# EAGLE design 4x4_hirose_100drill_250pad (EAGLE 7.3.0)
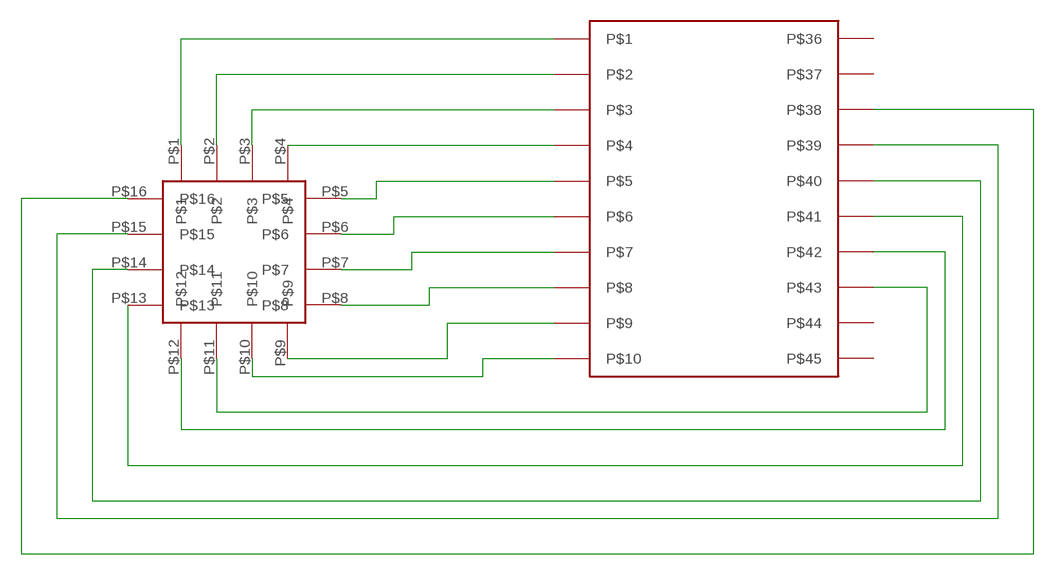
[diagram p0: schematic, sheet 1]

## Parts
U$1  GG_4X4_ARRAY  [GG_4X4_ARRAY]
U$2  HIROSE_DF40_70PIN  [HIROSE_DF40C-70DS]

## Nets
N$2: U$1.P$1 U$2.P$1
N$3: U$1.P$2 U$2.P$2
N$4: U$1.P$3 U$2.P$3
N$5: U$1.P$4 U$2.P$4
N$6: U$1.P$5 U$2.P$5
N$7: U$1.P$6 U$2.P$6
N$8: U$1.P$7 U$2.P$7
N$9: U$1.P$8 U$2.P$8
N$10: U$1.P$9 U$2.P$9
N$11: U$1.P$10 U$2.P$10
N$12: U$1.P$11 U$2.P$43
N$13: U$1.P$12 U$2.P$42
N$14: U$1.P$13 U$2.P$41
N$15: U$1.P$14 U$2.P$40
N$16: U$1.P$15 U$2.P$39
N$17: U$1.P$16 U$2.P$38
Unconnected: U$2.P$36 U$2.P$37 U$2.P$44 U$2.P$45

## Library data of the parts
U$1 = GG_4x4_3mildrill:GG_4X4_ARRAY
U$2 = GG_hirose20:HIROSE_DF40_70PIN

## Board
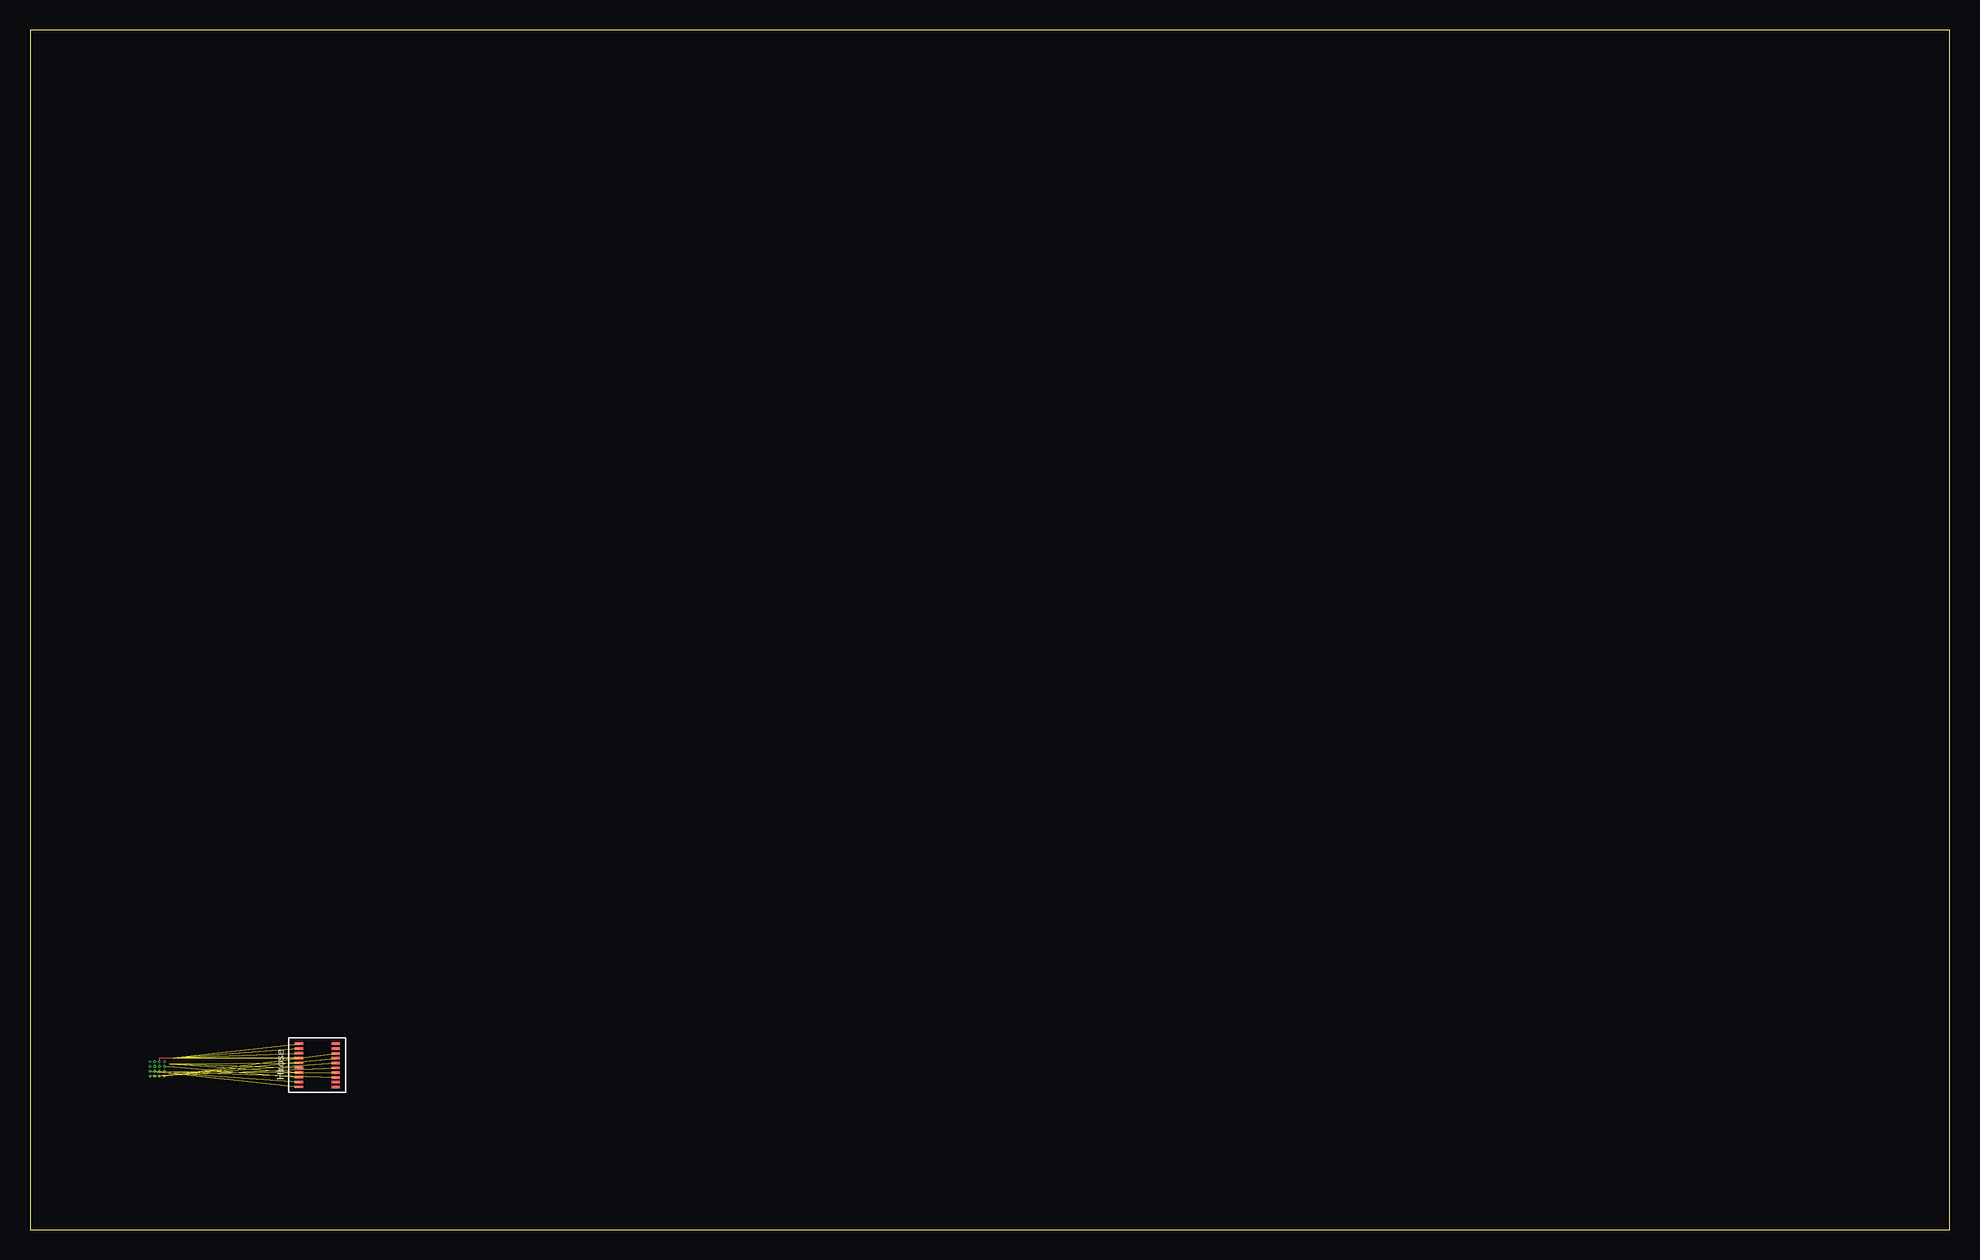
[diagram p1: board, top side]
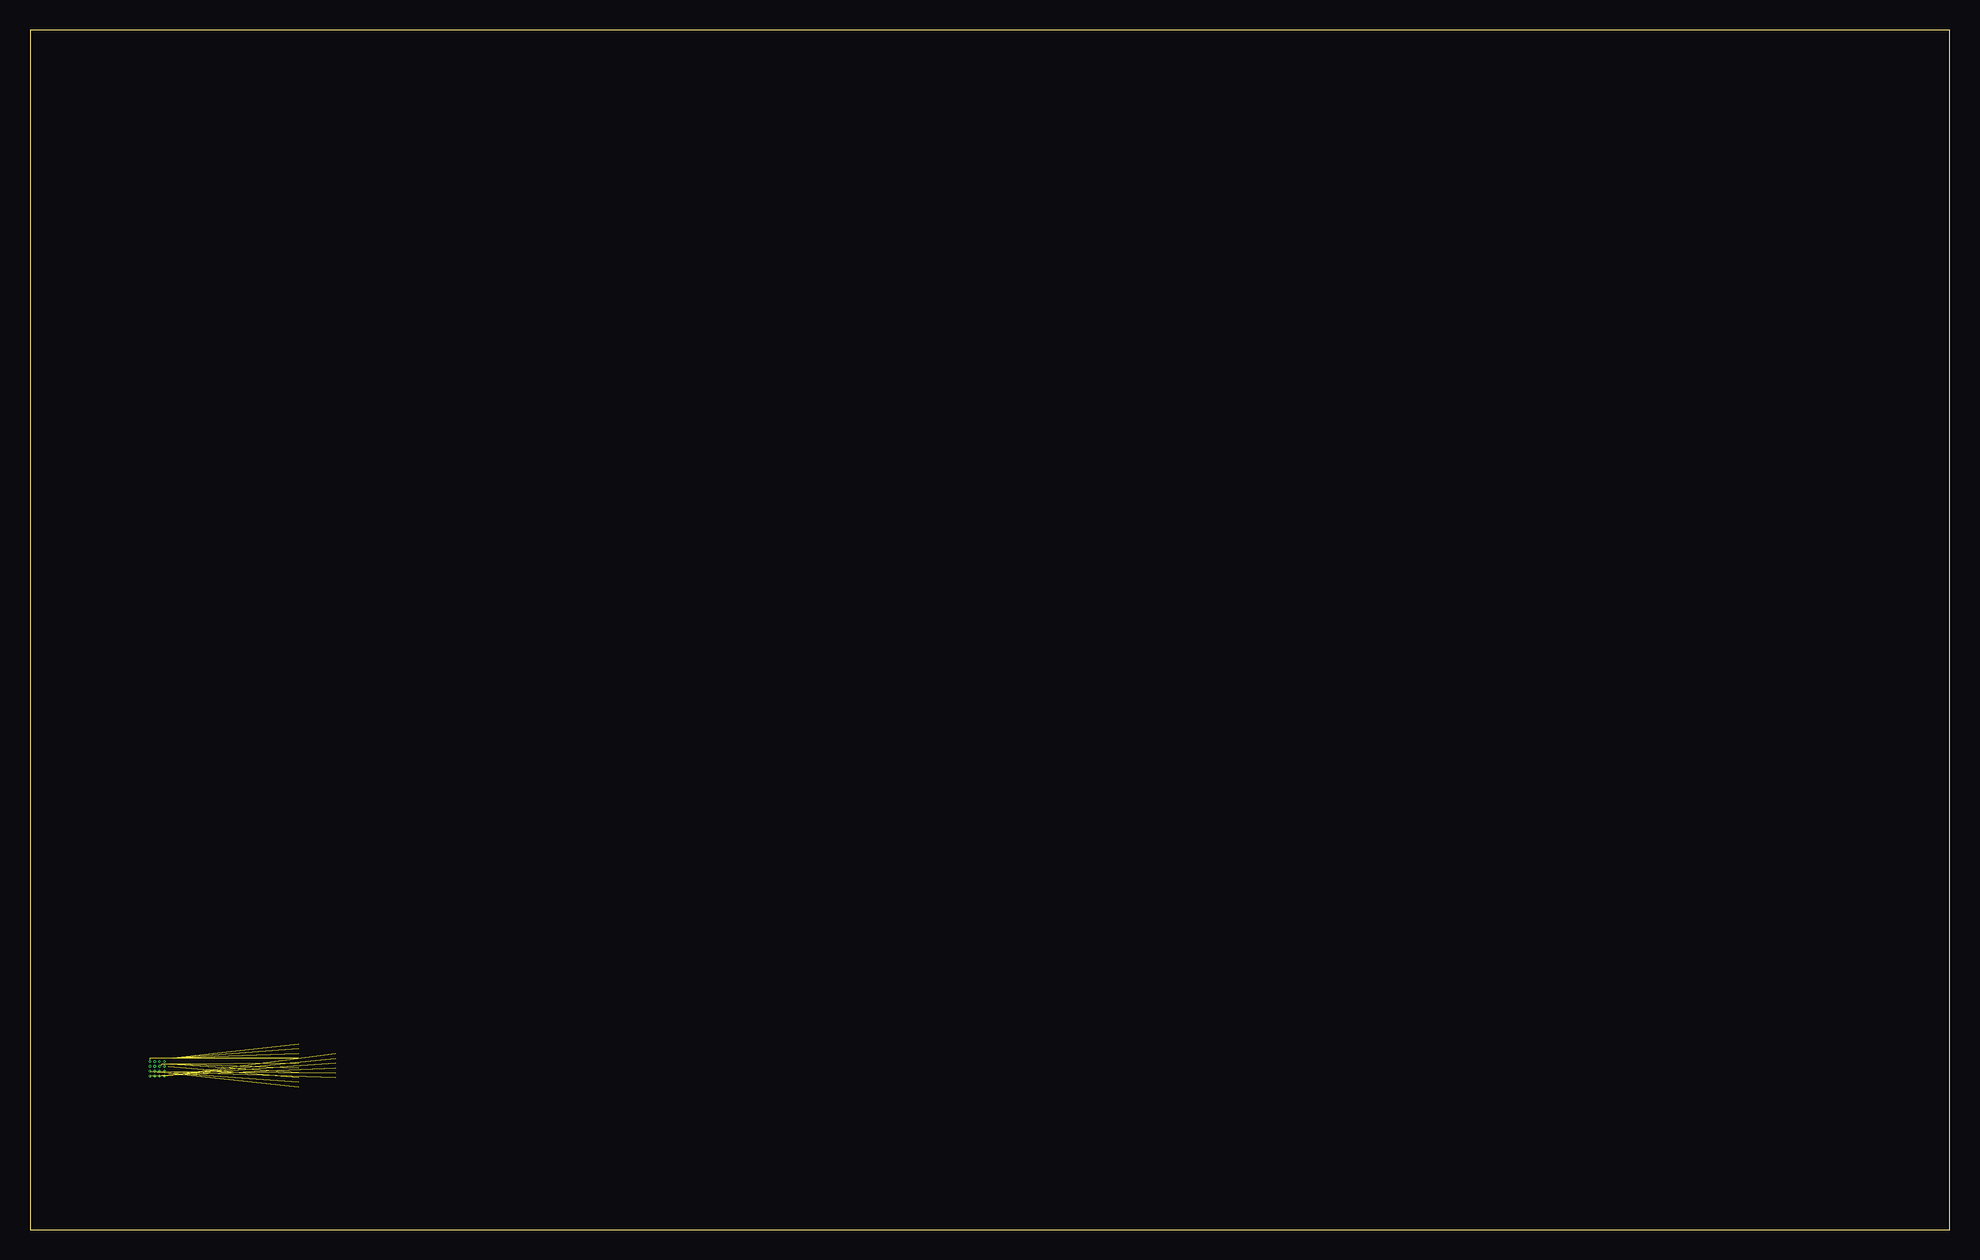
[diagram p2: board, inner layer Route2]
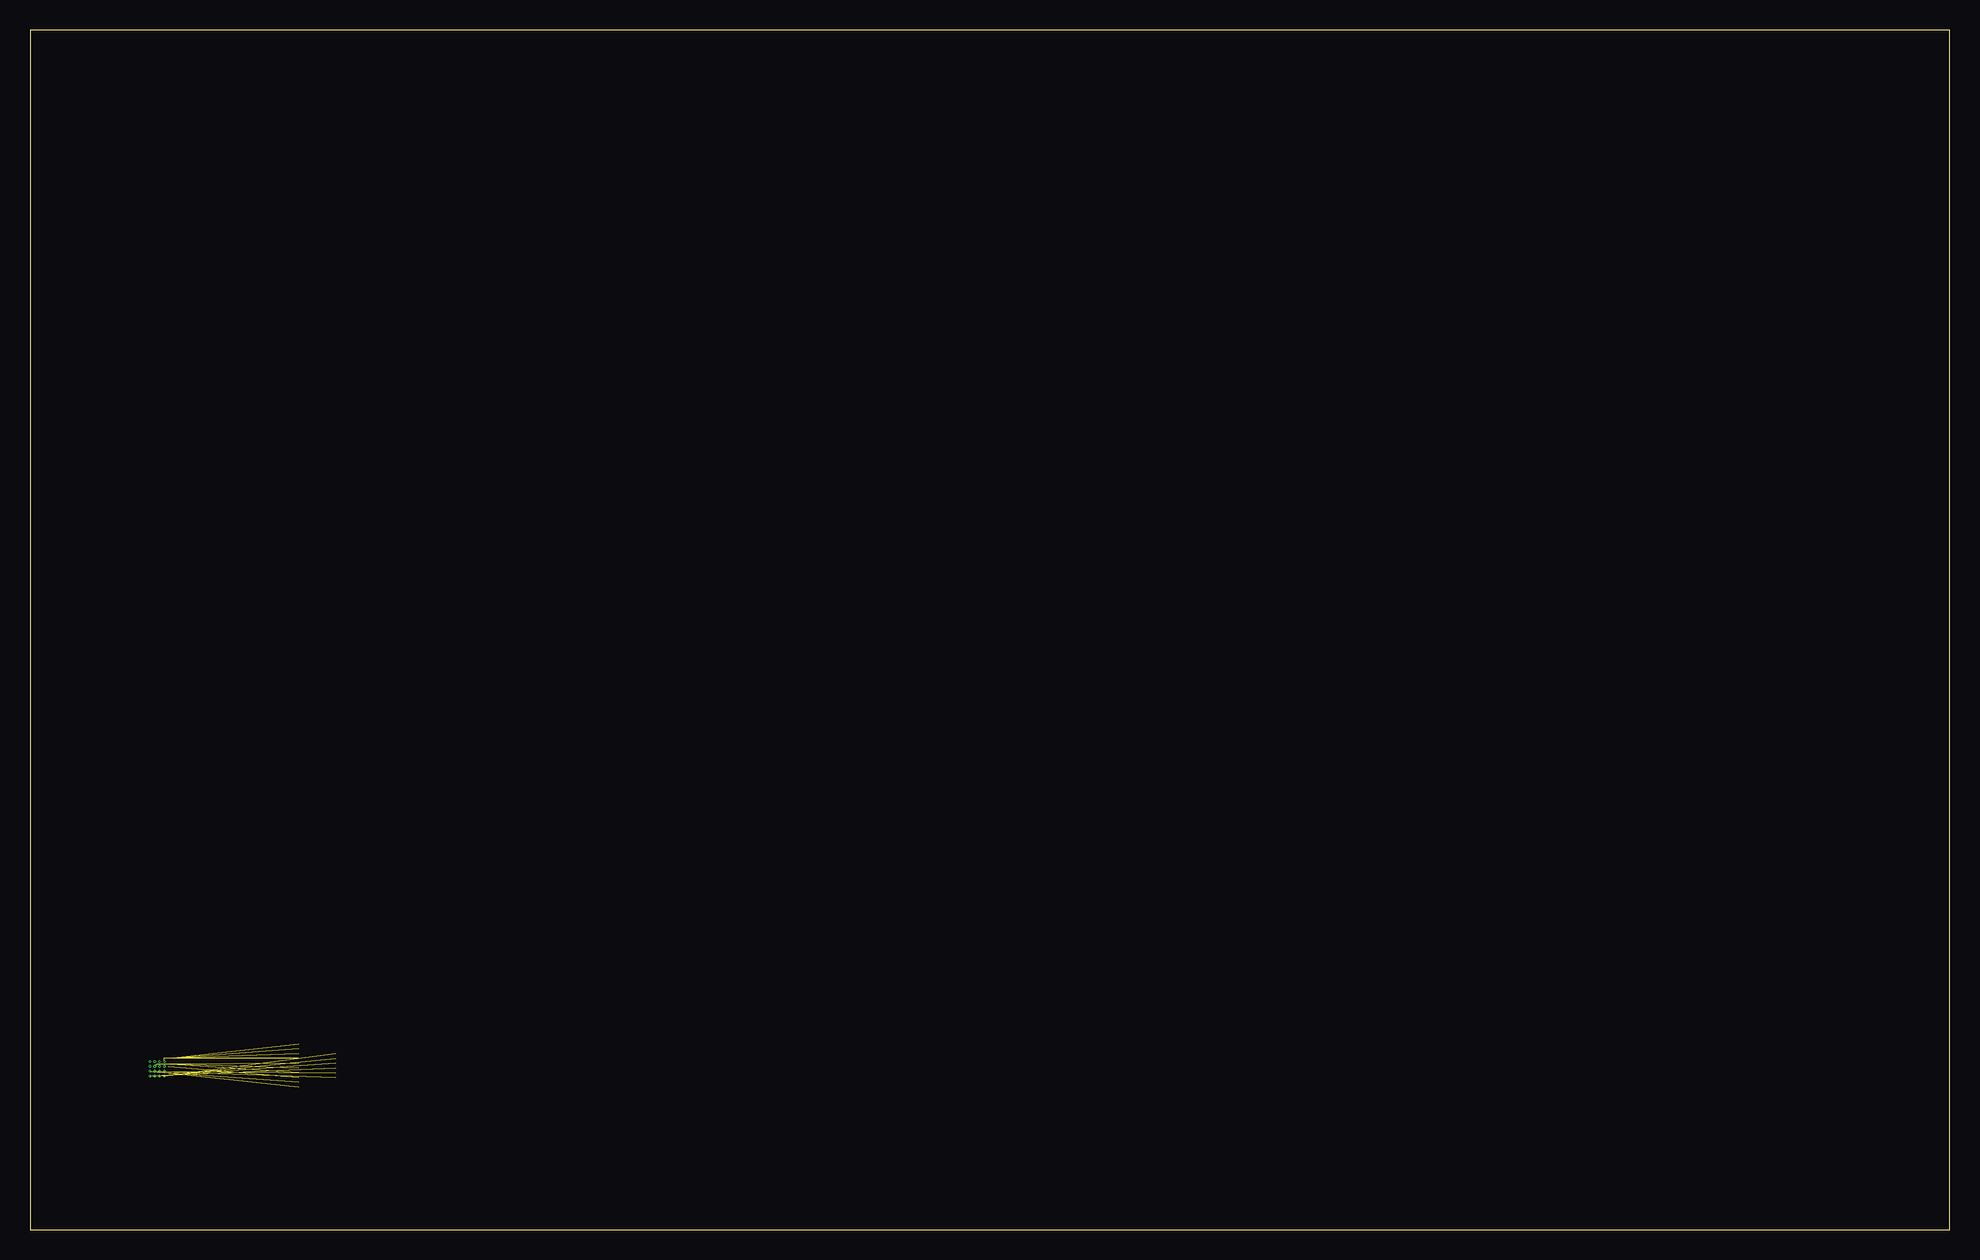
[diagram p3: board, inner layer Route15]
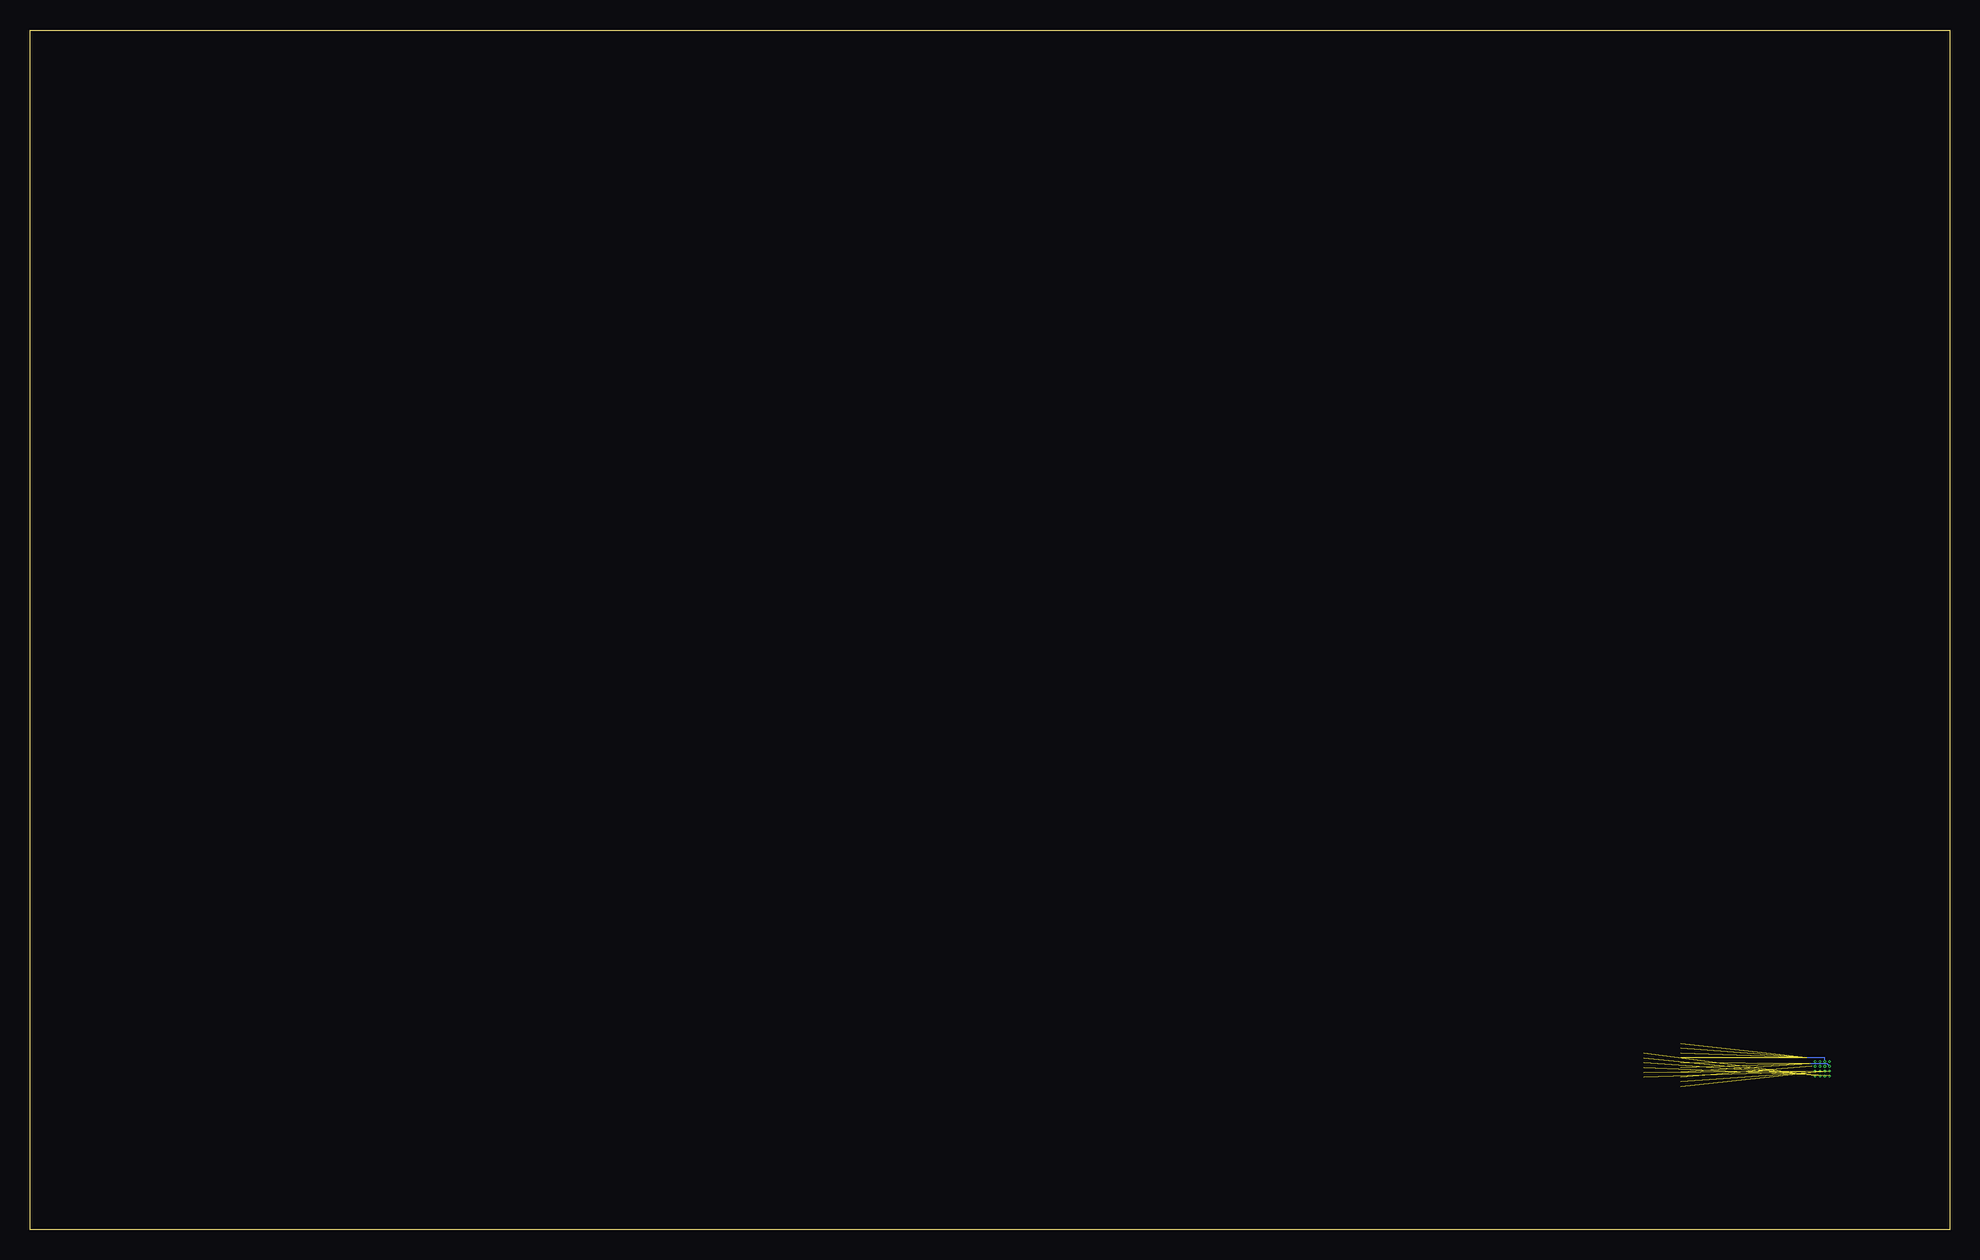
[diagram p4: board, bottom side, seen from below]

Size 160 x 100 mm. Coordinates in mm from the lower left corner, seen from the top.
Outline: 0,0 160,0 160,100 0,100 0,0
Copper layers (1*2*15*16): Top 0.035mm / dielectric 1.5mm / Route2 0.035mm / dielectric 0.15mm / Route15 0.035mm / dielectric 0.2mm / Bottom 0.035mm
Design rules "default *": minimum track width 3mil, minimum drill 0.1mm, track to track 0.15mm, track to pad 0.15mm, pad to pad 0.15mm, via to via 0.15mm, smd to smd 0.15mm, copper to edge 40mil, drill to drill 0.15mm, minimum pad ring 3mil, minimum via ring 3mil, stop-mask expansion 4mil, vias tented up to drill 0mil, thermal gap 10mil

### Footprints (pad centres in the part's own frame; a part is rotated, then mirrored left to right if it is on the bottom)
GG_4X4_ARRAY = drill 0.076 pad 0.178: P$1 0,0; P$2 0.4,0; P$3 0.8,0; P$4 1.2,0; P$5 0,-0.4; P$6 0.4,-0.4; P$7 0.8,-0.4; P$8 1.2,-0.4; P$9 0,-0.8; P$10 0.4,-0.8; P$11 0.8,-0.8; P$12 1.2,-0.8; P$13 0,-1.2; P$14 0.4,-1.2; P$15 0.8,-1.2; P$16 1.2,-1.2
HIROSE_DF40C-70DS = smd 0.2 x 0.7: P$1 0,0; P$2 -0.4,0; P$3 -0.8,0; P$4 -1.2,0; P$5 -1.6,0; P$6 -2,0; P$7 -2.4,0; P$8 -2.8,0; P$9 -3.2,0; P$10 -3.6,0; P$36 0,-3.08; P$37 -0.42,-3.08; P$38 -0.82,-3.08; P$39 -1.22,-3.08; P$40 -1.62,-3.08; P$41 -2.02,-3.08; P$42 -2.42,-3.08; P$43 -2.82,-3.08; P$44 -3.22,-3.08; P$45 -3.62,-3.08

### Placement (x,y rotation side)
U$1  10,14 0 top
U$2  22.4,15.5 90 top

### Tracks (layer width: path | path; a pad name or v marks a point on that pad's centre or on a via)
N$2  (1 unrouted)
  Route2 0.07: U$1.P$1 10,14.3 11.9,14.3
N$3  (1 unrouted)
  Bottom 0.07: U$1.P$2 10.4,14.3 11.9,14.3
N$4  (1 unrouted)
  Top 0.07: U$1.P$3 10.8,14.3 11.9,14.3
N$5  (1 unrouted)
  Route15 0.07: U$1.P$4 11.2,14.3 11.9,14.3
N$6  (1 unrouted)
  Bottom 0.07: U$1.P$5 10.2,13.8 11.6,13.8
N$7  (1 unrouted)
  Route15 0.07: U$1.P$6 10.6,13.8 12.1,13.8
N$8  (1 unrouted)
  Route2 0.07: U$1.P$7 11,13.8 11.7,13.8
N$9  (1 unrouted)
  Top 0.07: U$1.P$8 11.5,13.6
N$10  (1 unrouted)
N$11  (1 unrouted)
N$12  (1 unrouted)
N$13  (1 unrouted)
N$14  (1 unrouted)
N$15  (1 unrouted)
N$16  (1 unrouted)
N$17  (1 unrouted)